# Altium project ROV_PCB_CHARGE.PrjPcb
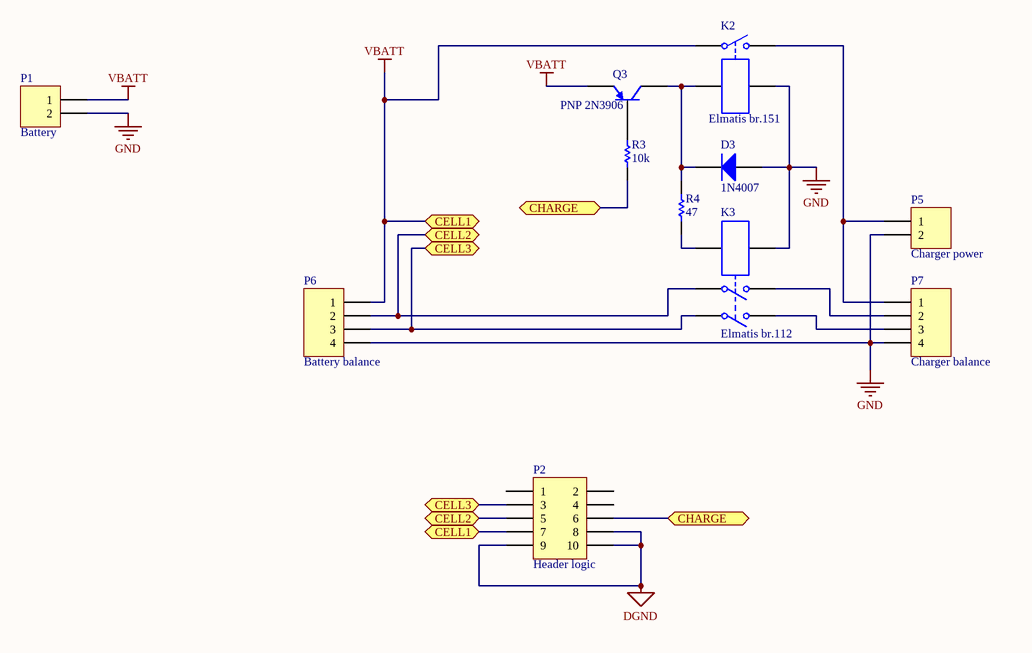
[diagram p0: ROV_PCB_CHARGE.SchDoc]
1 sheet, 11 parts. Net scope: flat (ports and power ports of the same name join across sheets).
Board file: ROV_PCB_CHARGE.PcbDoc

## Sheet ROV_PCB_CHARGE.SchDoc
size A4

### Parts
D3  1N4007  [DO-41]
K2  Elmatis br.151  [REL151]
K3  Elmatis br.112  [REL112]
P1  Battery  [Klema]
P2  Header logic  [HDR2X5]
P5  Charger power  [Klema]
P6  Battery balance  [HDR1X4]
P7  Charger balance  [HDR1X4]
Q3  PNP 2N3906  [MHDR1X3]
R3  10k  [AXIAL-0.3]
R4  47  [AXIAL-0.3]

### Ports
CELL1, CELL2, CELL3, CHARGE

### Nets
DGND: P2.8 P2.9 P2.10
GND: D3.1(A) K2.4 K3.6 P1.2 P5.2 P6.4 P7.4
VBATT: K2.1 P1.1 P2.7 P6.1 Q3.1(E) ; port CELL1
NetD3_2: D3.2(K) K2.3 Q3.3(C) R4.2
NetK2_2: K2.2 P5.1 P7.1
NetK3_1: K3.1 P2.3 P6.3 ; port CELL3
NetK3_2: K3.2 P7.3
NetK3_3: K3.3 P2.5 P6.2 ; port CELL2
NetK3_4: K3.4 P7.2
NetK3_5: K3.5 R4.1
NetP2_6: P2.6 R3.1 ; port CHARGE
NetQ3_2: Q3.2(B) R3.2

Not connected (* = marked no-connect by the designer): P2 1 2 4

### Library data of the parts
D3 = Diode 1N4007: 1 Amp General Purpose Rectifier; Published: 8-Jun-2000; LatestRevisionDate: 17-Jul-2002; LatestRevisionNote: Re-released for DXP Platform.; DatasheetVersion: 1998; PackageVersion: Aug-1999; PackageReference: DO-41; Publisher: Altium Limited; PackageDescription: Diode, Axial; Body 5.2 x 2.7 mm (LxDia. max), Lead Dia. 0.86 mm (max); Code_JEDEC: DO-204-AL; ComponentLink1Description: Manufacturer Link; ComponentLink1URL: http://www.fairchildsemi.com/; ComponentLink2Description: Datasheet; ComponentLink2URL: http://www.fairchildsemi.com/ds/1N%2F1N4001.pdf
K2 = Relay-SPST: Single-Pole Single-Throw Relay; Part Number: 151; Spool R: 225; Spool voltage: 9; Published: 24-Mar-1999; LatestRevisionDate: 17-Jul-2002; LatestRevisionNote: Re-released for DXP Platform.; PackageReference: MODULE4; Publisher: Altium Limited; Supplier: Elmatis; Unit Price: 24 kn
K3 = Relay-DPST: Dual-Pole Single-Throw Relay; Part Number: 112; Spool R: 90; Spool voltage: 6; Published: 24-Mar-1999; LatestRevisionDate: 17-Jul-2002; LatestRevisionNote: Re-released for DXP Platform.; PackageReference: MODULE6; Publisher: Altium Limited; Supplier: Elmatis; Unit price: 37 kn
P1 P5 = Header 2: Header, 2-Pin; LatestRevisionDate: 17-Jul-2002; LatestRevisionNote: Re-released for DXP Platform.; Publisher: Altium Limited
P2 = Header 5X2: Header, 5-Pin, Dual row; LatestRevisionDate: 17-Jul-2002; LatestRevisionNote: Re-released for DXP Platform.; Publisher: Altium Limited
P6 P7 = Header 4: Header, 4-Pin; LatestRevisionDate: 17-Jul-2002; LatestRevisionNote: Re-released for DXP Platform.; Publisher: Altium Limited
Q3 = PNP: PNP Bipolar Transistor; Published: 8-Jun-2000; LatestRevisionDate: 29-May-2009; LatestRevisionNote: IPC-7351 Footprint Added.; PackageVersion: Aug-1999; PackageReference: SOT-23B; Publisher: Altium Limited; PackageDescription: 3-Pin SOT-23 Package 0.95 mm Pitch, 2.4 mm Lead Span; Supplier: Kronos; Unit price: 0.50 kn
R3 R4 = Res1: Resistor; Value: 1K; Published: 8-Jun-2000; LatestRevisionDate: 17-Jul-2002; LatestRevisionNote: Re-released for DXP Platform.; PackageReference: AXIAL-0.3; Publisher: Altium Limited; PackageDescription: Axial Device, Thru-Hole; 2 Leads; 0.3 in Pin Spacing